# EAGLE design usb2ttl (EAGLE 9.6.1)
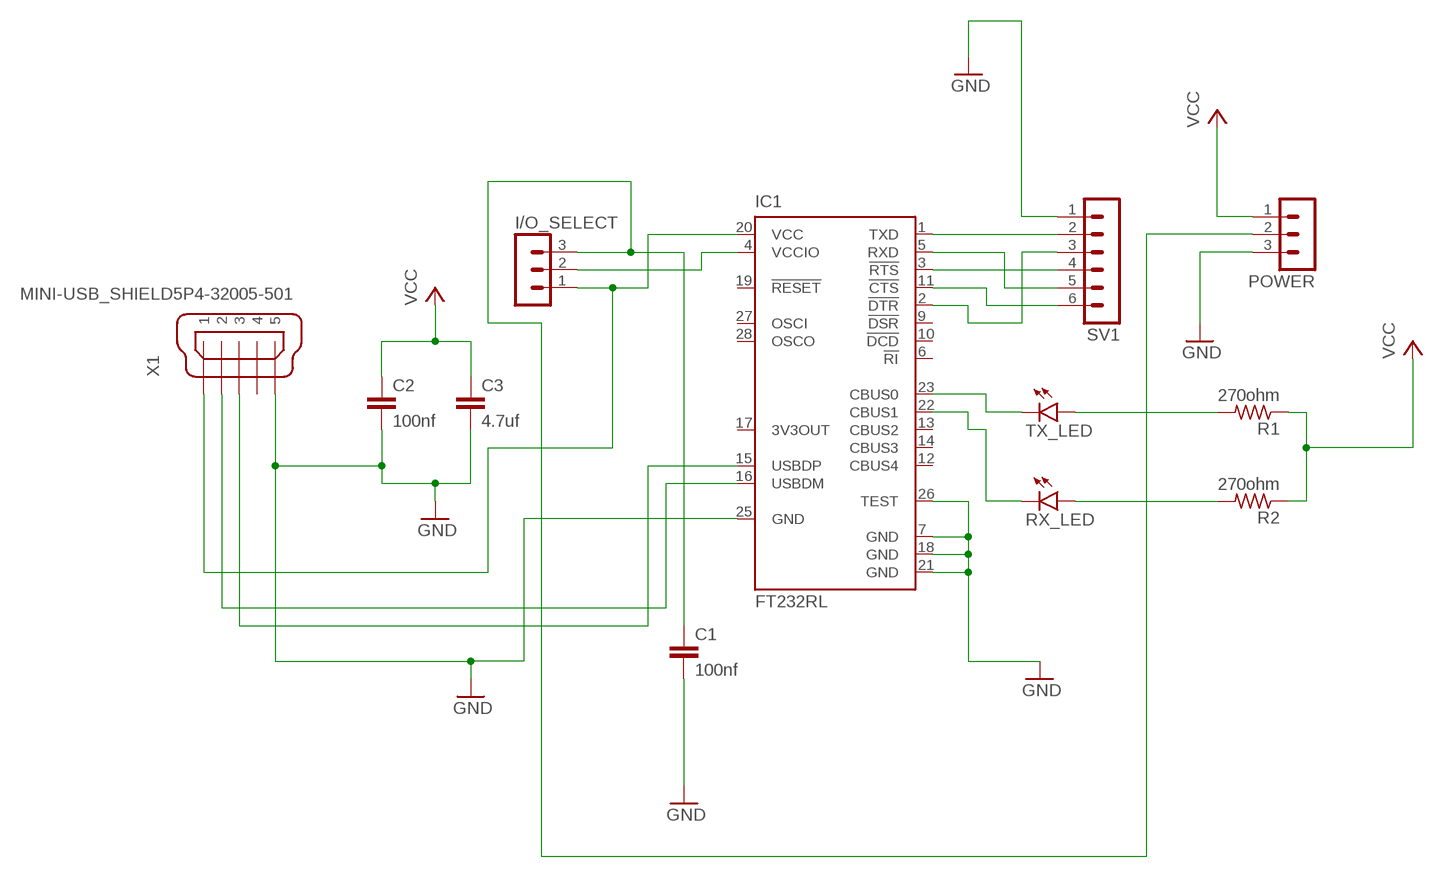
[diagram p0: schematic, sheet 1]

## Parts
C1  100nf  C2,5-3  [C2.5-3]
C2  100nf  C2,5-3  [C2.5-3]
C3  4.7uf  C2,5-3  [C2.5-3]
I/O_SELECT  MA03-1  [MA03-1]
IC1  FT232RL  [SSOP28]
POWER  MA03-1  [MA03-1]
R1  270ohm  R-US_0204/7  [0204/7]
R2  270ohm  R-US_0204/7  [0204/7]
RX_LED  LED5MM  [LED5MM]
SV1  MA06-1  [MA06-1]
TX_LED  LED5MM  [LED5MM]
X1  MINI-USB_SHIELD5P4-32005-501  [32005-501]

## Nets
GND: C1.2 C2.2 C3.2 IC1.7(GND) IC1.18(GND) IC1.21(GND) IC1.25(GND) IC1.26(TEST) POWER.3 SV1.1 X1.5
N$1: I/O_SELECT.1 IC1.20(VCC) X1.1
N$2: I/O_SELECT.2 IC1.4(VCCIO)
N$3: C1.1 I/O_SELECT.3 POWER.2
N$5: IC1.15(USBDP) X1.3
N$6: IC1.16(USBDM) X1.2
N$7: IC1.1(TXD) SV1.2
N$8: IC1.5(RXD) SV1.5
N$9: IC1.3(!RTS) SV1.4
N$10: IC1.11(!CTS) SV1.6
N$11: IC1.2(!DTR) SV1.3
N$12: IC1.23(CBUS0) TX_LED.K(C)
N$13: IC1.22(CBUS1) RX_LED.K(C)
N$14: R1.2 TX_LED.A
N$15: R2.2 RX_LED.A
VCC: C2.1 C3.1 POWER.1 R1.1 R2.1
Unconnected: IC1.6(!RI) IC1.9(!DSR) IC1.10(!DCD) IC1.12(CBUS4) IC1.13(CBUS2) IC1.14(CBUS3) IC1.17(3V3OUT) IC1.19(!RESET) IC1.27(OSCI) IC1.28(OSCO) X1.4 X1.M1(S1) X1.M2(S2) X1.M3(S3) X1.M4(S4)

## Library data of the parts
C1-C3 = capacitor-wima:C: CAPACITOR naming: grid - package width
I/O_SELECT POWER = con-lstb:MA03-1: PIN HEADER; OC_FARNELL: unknown; OC_NEWARK: unknown
IC1 = ftdichip:FT232R: Source: http://www.ftdichip.com/Documents/DataSheets/DS_FT232R_v104.pdf; MPN: FT232RL; OC_FARNELL: 1146032; OC_NEWARK: 91K9918
R1 R2 = rcl:R-US_: RESISTOR, American symbol; SPICEPREFIX: R
RX_LED TX_LED = led:LED: LED OSRAM: - CHIPLED LG R971, LG N971, LY N971, LG Q971, LY Q971, LO R971, LY R971 LH N974, LH R974 LS Q976, LO Q976, LY Q976 LO Q996 - Hyper CHIPLED LW Q18S LB Q993, LB Q99A, LB R99A - SideLED LS A670, LO A670, LY A670, LG A670, LP A670 LB A673, LV A673, LT A673, LW A673 LH A674 LY A675 LS A676, LA A676, LO A676, LY A676, LW A676 LS A679, LY A679, LG A679 - Hyper Micro SIDELED® LS Y876, LA Y876, LO Y876, LY Y876 LT Y87S - SmartLED LW L88C, LW L88S LB L89C, LB L89S, LG L890 LS L89K, LO L89K, LY L89K LS L896, LA L896, LO L896, LY L896 - TOPLED LS T670, LO T670, LY T670, LG T670, LP T670 LSG T670, LSP T670, LSY T670, LOP T670, LYG T670 LG T671, LOG T671, LSG T671 LB T673, LV T673, LT T673, LW T673 LH T674 LS T676, LA T676, LO T676, LY T676, LB T676, LH T676, LSB T676, LW T676 LB T67C, LV T67C, LT T67C, LS T67K, LO T67K, LY T67K, LW E67C LS E67B, LA E67B, LO E67B, LY E67B, LB E67C, LV E67C, LT E67C LW T67C LS T679, LY T679, LG T679 LS T770, LO T770, LY T770, LG T770, LP T770 LB T773, LV T773, LT T773, LW T773 LH T774 LS E675, LA E675, LY E675, LS T675 LS T776, LA T776, LO T776, LY T776, LB T776 LHGB T686 LT T68C, LB T68C - Hyper Mini TOPLED® LB M676 - Mini TOPLED Santana® LG M470 LS M47K, LO M47K, LY M47K Source: http://www.osram.convergy.de LUXEON: - LUMILED® LXK2-PW12-R00, LXK2-PW12-S00, LXK2-PW14-U00, LXK2-PW14-V00 LXK2-PM12-R00, LXK2-PM12-S00, LXK2-PM14-U00 LXK2-PE12-Q00, LXK2-PE12-R00, LXK2-PE12-S00, LXK2-PE14-T00, LXK2-PE14-U00 LXK2-PB12-K00, LXK2-PB12-L00, LXK2-PB12-M00, LXK2-PB14-N00, LXK2-PB14-P00, LXK2-PB14-Q00 LXK2-PR12-L00, LXK2-PR12-M00, LXK2-PR14-Q00, LXK2-PR14-R00 LXK2-PD12-Q00, LXK2-PD12-R00, LXK2-PD12-S00 LXK2-PH12-R00, LXK2-PH12-S00 LXK2-PL12-P00, LXK2-PL12-Q00, LXK2-PL12-R00 Source: www.luxeon.com KINGBRIGHT: KA-3528ASYC Source: www.kingbright.com
SV1 = con-lstb:MA06-1: PIN HEADER; OC_FARNELL: unknown; OC_NEWARK: unknown
X1 = con-cypressindustries:MINI-USB_SHIELD5P4-: MINI USB-B R/A W/O POST 5 pol. Source: www.cypressindustries.com; OC_FARNELL: unknown; OC_NEWARK: unknown

## Board
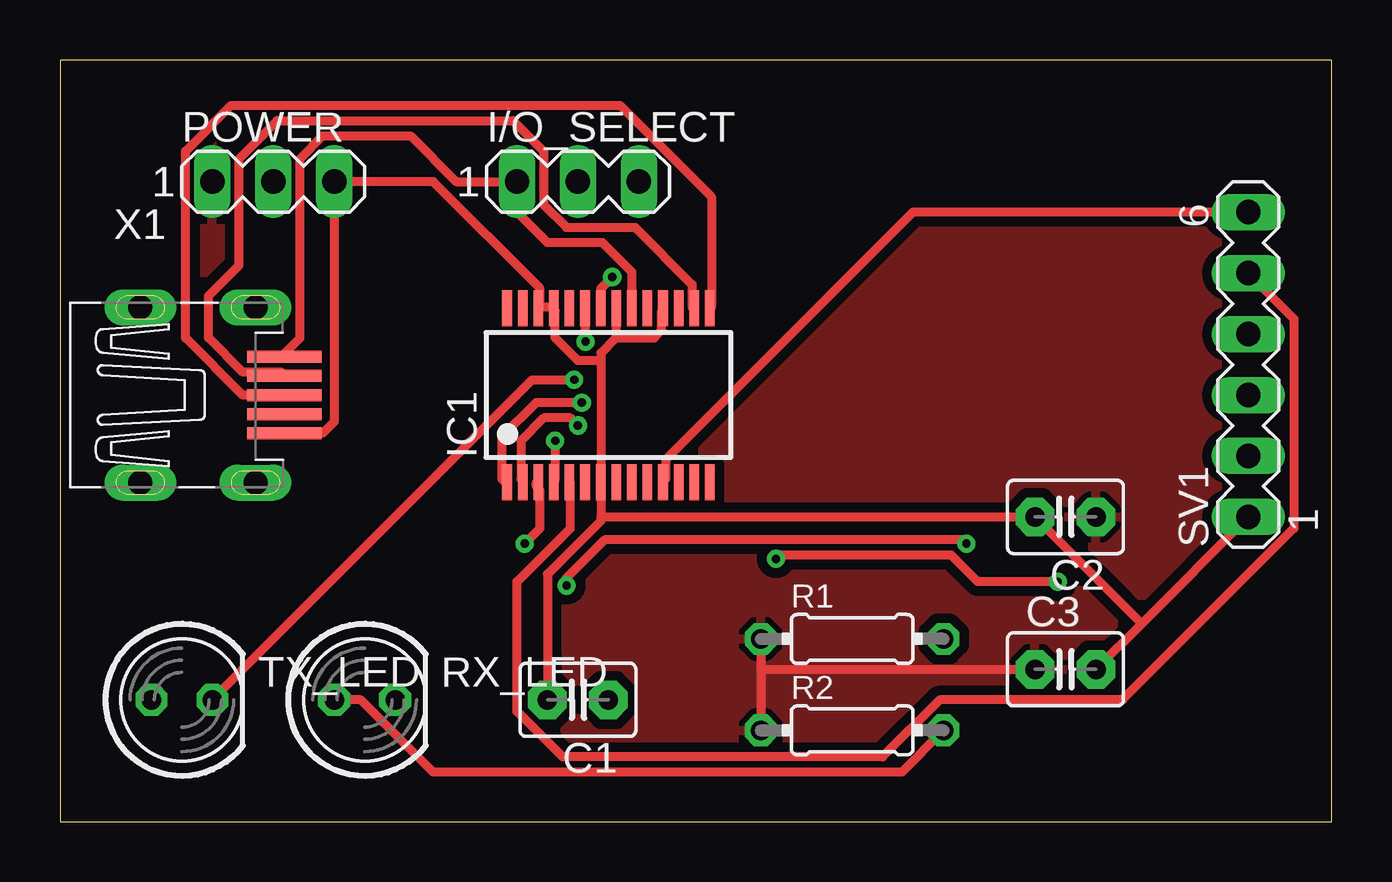
[diagram p1: board, top side]
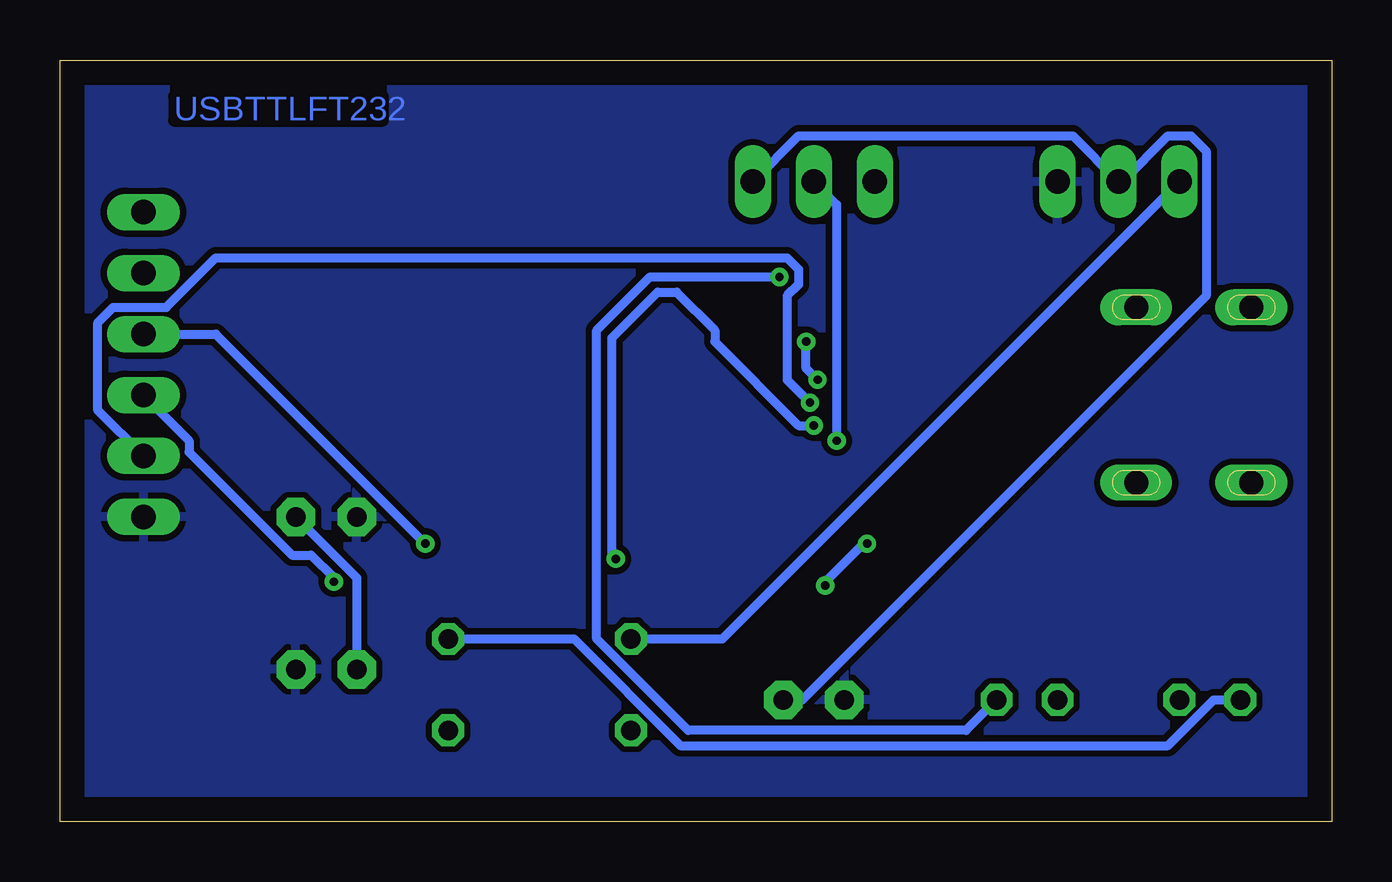
[diagram p2: board, bottom side, seen from below]

Size 53.01 x 31.74 mm. Coordinates in mm from the lower left corner, seen from the top.
Outline: 0,0 53.01,0 53.01,31.74 0,31.74 0,0
Copper layers (1*16): Top 0.035mm / dielectric 1.5mm / Bottom 0.035mm
Design rules "default *": minimum track width 15mil, minimum drill 0.35mm, track to track 10mil, track to pad 6mil, pad to pad 6mil, via to via 6mil, smd to smd 6mil, copper to edge 40mil, drill to drill 6mil, minimum pad ring 10mil, minimum via ring 8mil, stop-mask expansion 4mil, vias tented up to drill 0mil, thermal gap 10mil

### Footprints (pad centres in the part's own frame; a part is rotated, then mirrored left to right if it is on the bottom)
C2.5-3 = drill 0.813 pad 1.6 octagon: 1 -1.27,0; 2 1.27,0
MA03-1 = drill 1.016 long: 1 -2.54,0; 2 0,0; 3 2.54,0
SSOP28 = smd 0.4 x 1.5: 1 -4.225,-3.625; 2 -3.575,-3.625; 3 -2.925,-3.625; 4 -2.275,-3.625; 5 -1.625,-3.625; 6 -0.975,-3.625; 7 -0.325,-3.625; 8 0.325,-3.625; 9 0.975,-3.625; 10 1.625,-3.625; 11 2.275,-3.625; 12 2.925,-3.625; 13 3.575,-3.625; 14 4.225,-3.625; 15 4.225,3.625; 16 3.575,3.625; 17 2.925,3.625; 18 2.275,3.625; 19 1.625,3.625; 20 0.975,3.625; 21 0.325,3.625; 22 -0.325,3.625; 23 -0.975,3.625; 24 -1.625,3.625; 25 -2.275,3.625; 26 -2.925,3.625; 27 -3.575,3.625; 28 -4.225,3.625
0204/7 = drill 0.813 octagon: 1 -3.81,0; 2 3.81,0
LED5MM = drill 0.813 octagon: A -1.27,0; K 1.27,0
MA06-1 = drill 1.016 long: 1 -6.35,0; 2 -3.81,0; 3 -1.27,0; 4 1.27,0; 5 3.81,0; 6 6.35,0
32005-501 = smd 3.1 x 0.5: 1 3,1.6; 2 3,0.8; 3 3,0; 4 3,-0.8; 5 3,-1.6 | drill 1 pad 1.422 long: M1 -3,3.65; M2 -3,-3.65; M3 1.8,3.65; M4 1.8,-3.65

### Placement (x,y rotation side)
C1  21.59,5.08 180 top
C2  41.91,12.7 180 top
C3  41.91,6.35 0 top
I/O_SELECT  21.59,26.67 0 top
IC1  22.86,17.78 0 top
POWER  8.89,26.67 0 top
R1  33.02,7.62 0 top
R2  33.02,3.81 0 top
RX_LED  12.7,5.08 0 top
SV1  49.53,19.05 90 top
TX_LED  5.08,5.08 0 top
X1  6.35,17.78 0 top

### Tracks (layer width: path | path; a pad name or v marks a point on that pad's centre or on a via)
GND
  Top 0.381: C3.2 45.08,8.26 | 45.08,8.26 SV1.1 | 45.08,8.26 C2.2 22.54,12.7 | 22.54,19.21 22.54,19.53 23.18,20.16 | 22.54,19.21 22.54,14.29 IC1.7 22.54,13.97 22.54,12.7 | 23.18,20.16 23.18,21.27 IC1.21 | 23.18,20.16 24.77,20.16 25.08,20.48 25.08,21.27 IC1.18 | 22.54,19.21 21.59,19.21 20.64,20.16 20.64,21.27 IC1.25 20.48,21.43 20,21.43 IC1.26 20,21.59 20,22.23 15.56,26.67 POWER.3 11.43,16.67 10.95,16.19 9.37,16.19 X1.5 | C1.2 20.32,10.32 22.54,12.54 22.54,12.7
  pour Bottom: 0,31.75 53.34,31.75 53.34,0 0,0
N$1
  Top 0.381: X1.1 9.37,19.53 10,20.16 10,27.62 10.95,28.57 14.61,28.57 16.51,26.67 I/O_SELECT.1 19.05,25.4 20.32,24.13 22.61,24.13 23.83,22.91 IC1.20
N$2  (via drill 0.35)
  Top 0.381: v20.64,15.88 20.64,14.29 IC1.4
  Bottom 0.381: v20.64,15.88 20.64,25.72 I/O_SELECT.2
N$3
  Bottom 0.381: I/O_SELECT.3 22.23,28.57 10.79,28.57 POWER.2 8.73,26.67 6.83,28.57 5.87,28.57 5.24,27.94 5.24,21.91 22.07,5.08 C1.1
N$5
  Top 0.381: X1.3 7.62,17.78 5.24,20.16 5.24,27.94 7.14,29.84 23.34,29.84 27.15,26.04 27.15,21.43 IC1.15
N$6
  Top 0.381: IC1.16 26.35,21.43 26.35,22.38 23.97,24.77 21.11,24.77 20.16,25.72 20.16,27.94 18.89,29.21 9.05,29.21 7.46,27.62 7.46,23.18 6.19,21.91 6.19,20.16 7.62,18.73 9.21,18.73 X1.2
N$7  (via drill 0.35)
  Top 0.381: v21.75,17.46 19.84,17.46 18.41,16.03 18.41,14.29 18.57,14.13 IC1.1
  Bottom 0.381: v21.75,17.46 22.7,18.41 22.7,21.91 22.23,22.38 22.23,23.02 22.7,23.5 46.51,23.5 48.58,21.43 50.8,21.43 51.43,20.8 51.43,17.14 SV1.2
N$8
  Top 0.381: SV1.5 51.43,20.96 51.43,12.22 44.29,5.08 36.67,5.08 34.29,2.7 20.96,2.7 19.05,4.6 19.05,10 21.27,12.22 21.27,14.13 IC1.5
N$9  (via drill 0.35)
  Top 0.381: v19.37,11.59 20,12.22 20,13.81 19.84,13.97 19.84,14.13 IC1.3 | v21.11,9.84 21.11,10.16 22.7,11.75 37.62,11.75 v37.78,11.59
  Bottom 0.381: v19.37,11.59 19.53,11.59 21.11,10 v21.11,9.84 | v37.78,11.59 46.51,20.32 SV1.4
N$10
  Top 0.381: SV1.6 35.56,25.4 25.24,15.08 25.24,14.29 IC1.11
N$11  (via drill 0.35)
  Top 0.381: v21.59,16.51 21.27,16.83 20.16,16.83 19.21,15.88 19.21,14.29 IC1.2 | v29.84,10.95 30,11.11 37.15,11.11 38.26,10 v41.59,10
  Bottom 0.381: v21.59,16.51 22.23,16.51 25.72,20 25.72,20.48 27.3,22.07 28.1,22.07 30,20.16 30,11.11 v29.84,10.95 | v41.59,10 41.59,10.16 42.54,11.11 43.34,11.11 47.62,15.4 47.62,15.88 SV1.3
N$12  (via drill 0.35)
  Top 0.381: v21.91,20 21.91,21.27 IC1.23 | v21.43,18.41 19.68,18.41 TX_LED.K
  Bottom 0.381: v21.91,20 21.91,18.89 v21.43,18.41
N$13  (via drill 0.35)
  Top 0.381: v23.02,22.7 22.54,22.23 22.54,21.43 IC1.22
  Bottom 0.381: v23.02,22.7 28.42,22.7 30.64,20.48 30.64,7.62 26.83,3.81 15.24,3.81 RX_LED.K
N$14
  Bottom 0.381: TX_LED.A 4.92,5.08 6.83,3.18 27.15,3.18 31.59,7.62 R1.2
N$15
  Top 0.381: RX_LED.A 12.54,5.08 15.56,2.06 35.08,2.06 R2.2
VCC
  Top 0.381: R1.1 29.21,6.35 | 29.21,6.35 R2.1 | 29.21,6.35 C3.1
  Bottom 0.381: C3.1 40.64,10.16 C2.1 | POWER.1 25.4,7.62 R1.1
  pour Top (isolate 0.406): 0,31.75 53.34,31.75 53.34,0 0,0

### Text on the board
Bottom: USBTTLFT232